# EAGLE design USB-Audio_ver_1_0 (EAGLE 9.6.2)
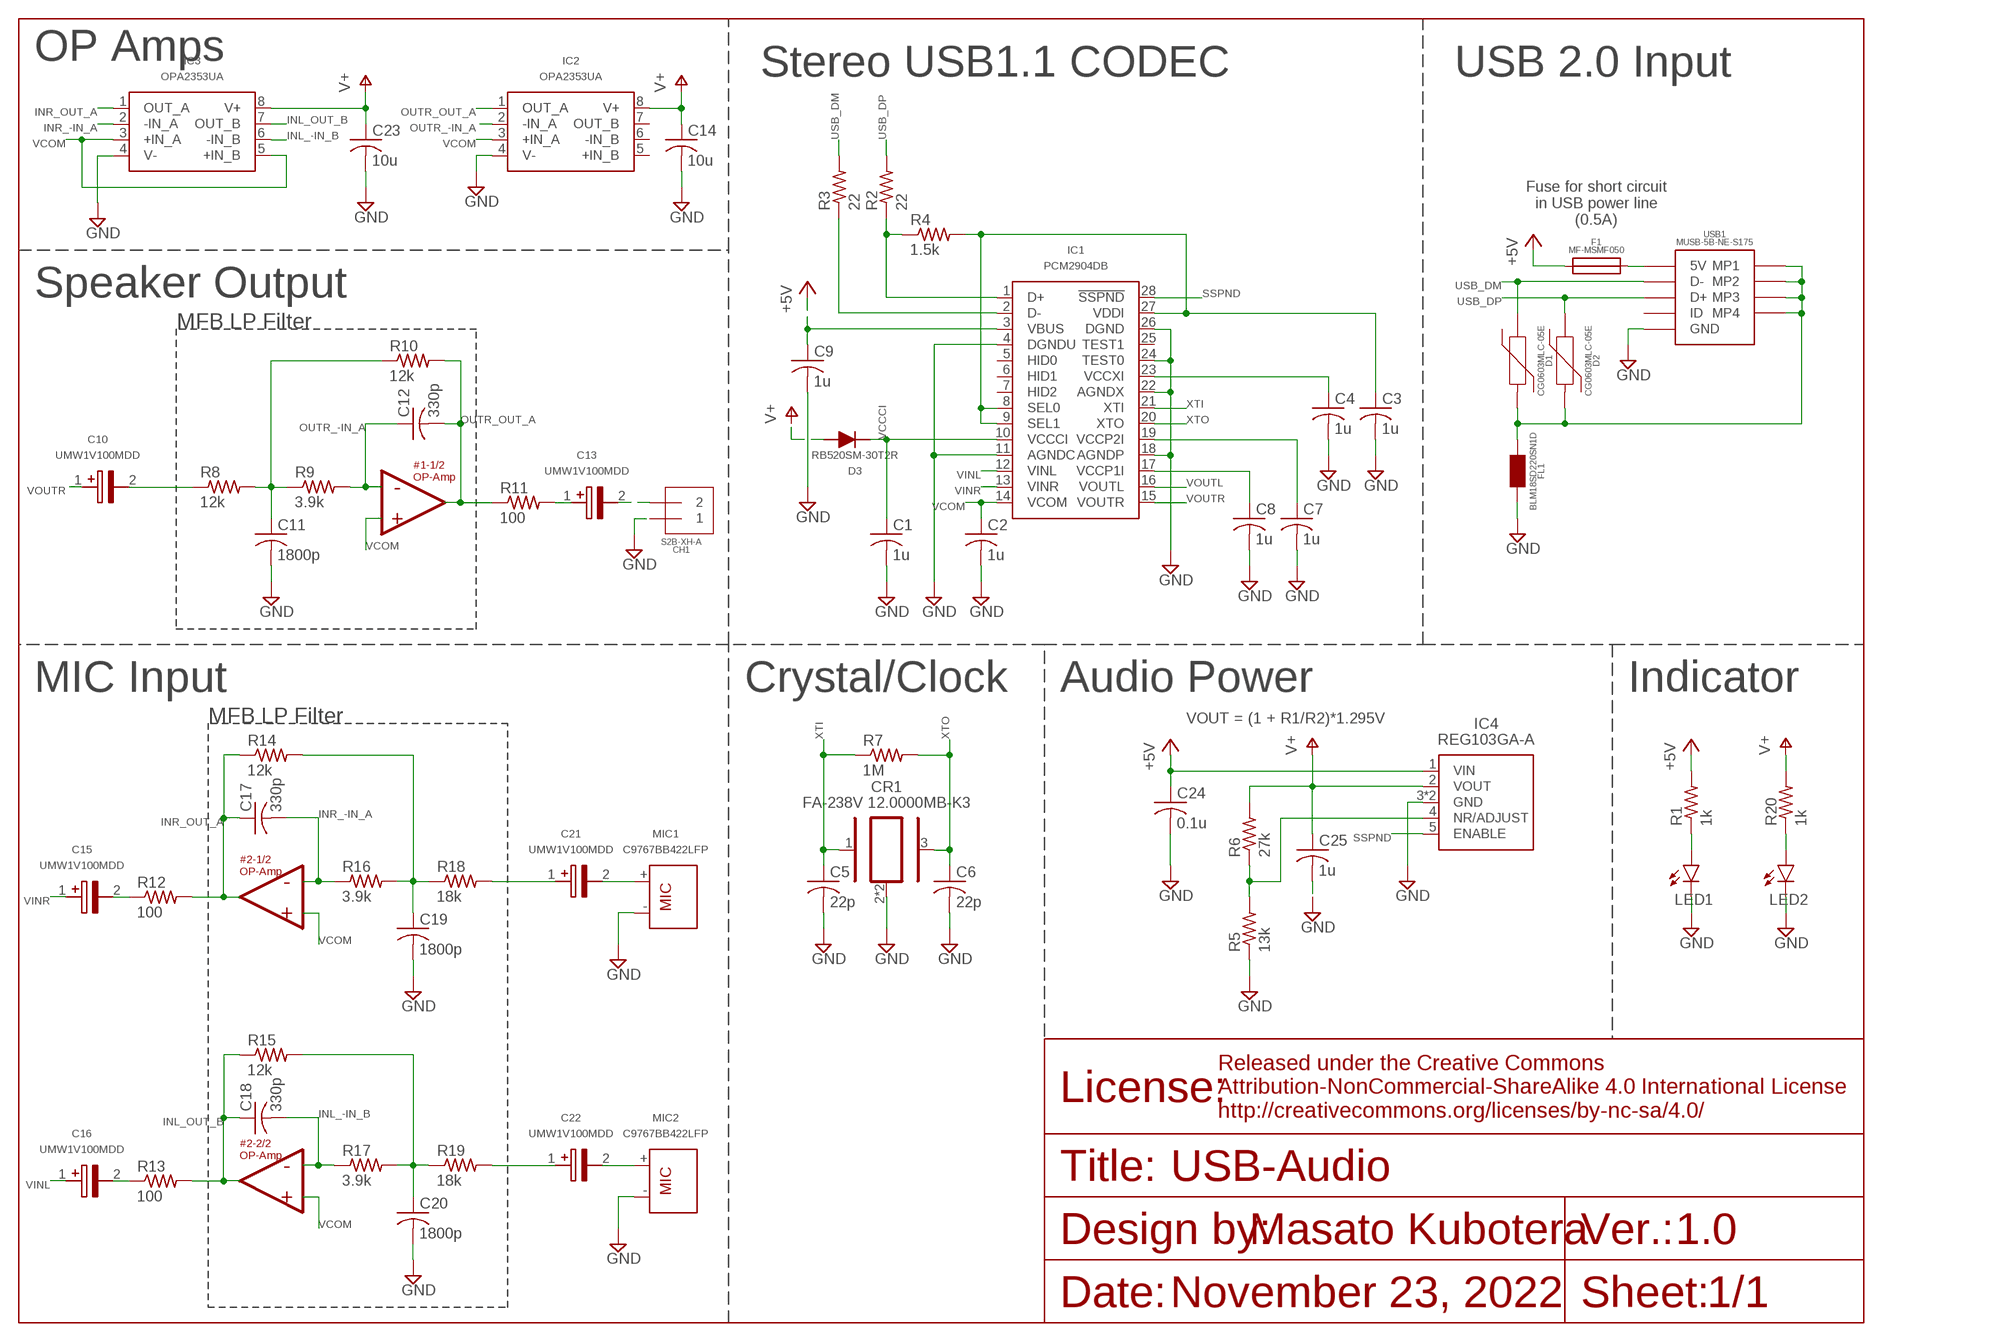
[diagram p0: schematic, sheet 1]

## Parts
C1  1u  C-USC1608  [C1608]
C2  1u  C-USC1608  [C1608]
C3  1u  C-USC1608  [C1608]
C4  1u  C-USC1608  [C1608]
C5  22p  C-USC1608  [C1608]
C6  22p  C-USC1608  [C1608]
C7  1u  C-USC1608  [C1608]
C8  1u  C-USC1608  [C1608]
C9  1u  C-USC1608  [C1608]
C10  UMW1V100MDD  [UMW1V100MDD]
C11  1800p  C-USC1608  [C1608]
C12  330p  C-USC1608  [C1608]
C13  UMW1V100MDD  [UMW1V100MDD]
C14  10u  C-USC1608  [C1608]
C15  UMW1V100MDD  [UMW1V100MDD]
C16  UMW1V100MDD  [UMW1V100MDD]
C17  330p  C-USC1608  [C1608]
C18  330p  C-USC1608  [C1608]
C19  1800p  C-USC1608  [C1608]
C20  1800p  C-USC1608  [C1608]
C21  UMW1V100MDD  [UMW1V100MDD]
C22  UMW1V100MDD  [UMW1V100MDD]
C23  10u  C-USC1608  [C1608]
C24  0.1u  C-USC1608  [C1608]
C25  1u  C-USC1608  [C1608]
CH1  S2B-XH-A  [S2B-XH-A]
CR1  FA-238V12.0000MB-K3  [FA238V]
D1  CG0603MLC-05E  [CG0603MLC-05E]
D2  CG0603MLC-05E  [CG0603MLC-05E]
D3  RB520SM-30T2R  [SOD-523-2]
F1  MF-MSMF050  [MF-MSMF050]
FL1  BLM18SD220SN1D  [BLM18SD220SN1D]
IC1  PCM2904DB  [PCM2904DB]
IC2  OPA2353UA  [OPA2353UA]
IC3  OPA2353UA  [OPA2353UA]
IC4  REG103GA-A  [SOT223-5]
LED1  LEDSML0603  [SML0603]
LED2  LEDSML0603  [SML0603]
MIC1  C9767BB422LFP  [C9767BB422LFP]
MIC2  C9767BB422LFP  [C9767BB422LFP]
R1  1k  R-US_R0603  [R0603]
R2  22  R-US_R0603  [R0603]
R3  22  R-US_R0603  [R0603]
R4  1.5k  R-US_R0603  [R0603]
R5  13k  R-US_R0603  [R0603]
R6  27k  R-US_R0603  [R0603]
R7  1M  R-US_R0603  [R0603]
R8  12k  R-US_R0603  [R0603]
R9  3.9k  R-US_R0603  [R0603]
R10  12k  R-US_R0603  [R0603]
R11  100  R-US_R0603  [R0603]
R12  100  R-US_R0603  [R0603]
R13  100  R-US_R0603  [R0603]
R14  12k  R-US_R0603  [R0603]
R15  12k  R-US_R0603  [R0603]
R16  3.9k  R-US_R0603  [R0603]
R17  3.9k  R-US_R0603  [R0603]
R18  18k  R-US_R0603  [R0603]
R19  18k  R-US_R0603  [R0603]
R20  1k  R-US_R0603  [R0603]
USB1  MINI_USB_B_SMD  [MINI_USB_B_SMD]

## Nets
+5V [USB-Power]: C9.1 C24.1 F1.1 IC1.3(VBUS) IC4.1(VIN) R1.2
B_FUSE_USB_MINI_B [USB-Power]: F1.2 USB1.1(5V)
DM: IC1.2(D-) R3.1
DP: IC1.1(D+) R2.1 R4.1
GND: C1.2 C2.2 C3.2 C4.2 C5.2 C6.2 C7.2 C8.2 C9.2 C11.2 C14.2 C19.2 C20.2 C23.2 C24.2 C25.2 CH1.1 CR1.2 CR1.4 FL1.2 IC1.4(DGNDU) IC1.11(AGNDC) IC1.18(AGNDP) IC1.22(AGNDX) IC1.24(TEST0) IC1.26(DGND) IC2.4(V-) IC3.4(V-) IC4.3(GND) IC4.6(GND) LED1.C LED2.C MIC1.- MIC2.- R5.1 USB1.5(GND)
INL_-IN_B: C18.2 IC3.6(-IN_B) R17.1
INL_OUT_B: C18.1 IC3.7(OUT_B) R13.2 R15.1
INR_-IN_A: C17.2 IC3.2(-IN_A) R16.1
INR_OUT_A: C17.1 IC3.1(OUT_A) R12.2 R14.1
LED_USBIN [LED-Power]: LED1.A R1.1
LED_USBIN1 [LED-Power]: LED2.A R20.1
MIC_INL: C22.2(-) MIC2.+
MIC_INR: C21.2(-) MIC1.+
N$1: C15.2(-) R12.1
N$2: C7.1 IC1.19(VCCP2I)
N$3: C13.2(-) CH1.2
N$4: IC4.4(NR/ADJUST) R5.2 R6.1
N$5: C13.1(+) R11.2
N$6: C10.2(-) R8.1
N$7: C11.1 R8.2 R9.1 R10.1
N$9: C16.2(-) R13.1
N$10: C19.1 R14.2 R16.2 R18.1
N$11: C21.1(+) R18.2
N$14: C22.1(+) R19.2
N$15: C20.1 R15.2 R17.2 R19.1
OUTR_-IN_A: C12.1 IC2.2(-IN_A) R9.2
OUTR_OUT_A: C12.2 IC2.1(OUT_A) R10.2 R11.1
SSPND: C8.1 IC1.17(VCCP1I) IC1.28(!SSPND) IC4.5(ENABLE)
USB_DM: D1.1 R3.2 USB1.2(D-)
USB_DP: D2.1 R2.2 USB1.3(D+)
USB_MINI_B_SHIELD [USB-Data]: D1.2 D2.2 FL1.1 USB1.MP1 USB1.MP2 USB1.MP3 USB1.MP4
V+ [USB-Power]: C14.1 C23.1 C25.1 D3.2(A) IC2.8(V+) IC3.8(V+) IC4.2(VOUT) R6.2 R20.2
VCCCI [USB-Power]: C1.1 D3.1(K) IC1.10(VCCCI)
VCCXI [USB-Power]: C4.1 IC1.23(VCCXI)
VCOM [USB-Power]: C2.1 IC1.14(VCOM) IC2.3(+IN_A) IC3.3(+IN_A) IC3.5(+IN_B)
VDDI [USB-Power]: C3.1 IC1.8(SEL0) IC1.9(SEL1) IC1.27(VDDI) R4.2
VINL: C16.1(+) IC1.12(VINL)
VINR: C15.1(+) IC1.13(VINR)
VOUTL [Audio-Output]: IC1.16(VOUTL)
VOUTR [Audio-Output]: C10.1(+) IC1.15(VOUTR)
XTI: C5.1 CR1.1 IC1.21(XTI) R7.1
XTO: C6.1 CR1.3 IC1.20(XTO) R7.2
Unconnected: IC1.5(HID0) IC1.6(HID1) IC1.7(HID2) IC1.25(TEST1) IC2.5(+IN_B) IC2.6(-IN_B) IC2.7(OUT_B) USB1.4(ID)

## Notes on the sheet
- OP Amps
- Stereo USB1.1 CODEC | USB 2.0 Input
- Fuse for short circuit
  in USB power line
  (0.5A)
- Speaker Output
- MFB LP Filter
- #1-1/2
  OP-Amp
- -
- +
- MIC Input | Crystal/Clock | Audio Power | Indicator
- MFB LP Filter | VOUT = (1 + R1/R2)*1.295V
- #2-1/2
  OP-Amp
- -
- +
- #2-2/2
  OP-Amp
- - | USB-Audio
- +
- 1.0
- November 23, 2022 | 1/1

## Library data of the parts
C1-C9 C11 C12 C14 C17-C20 C23-C25 = rcl:C-US: CAPACITOR, American symbol; SPICEPREFIX: C
C10 C13 C15 C16 C21 C22 = UMW1V100MDD:UMW1V100MDD
CH1 = JST-XH:S2B-XH-A
CR1 = FA238V:FA-238V12.0000MB-K3
D1 D2 = CG0603MLC-05E:CG0603MLC-05E
D3 = RB520SM-30T2R:RB520SM-30T2R
F1 = MF-MSMF:MF-MSMF050
FL1 = BLM18SD220SN1D:BLM18SD220SN1D
IC1 = PCM2904DB:PCM2904DB
IC2 IC3 = OPA2353UA:OPA2353UA
IC4 = REG103GA-A:REG103GA-A
LED1 LED2 = led:LED: LED OSRAM: - CHIPLED LG R971, LG N971, LY N971, LG Q971, LY Q971, LO R971, LY R971 LH N974, LH R974 LS Q976, LO Q976, LY Q976 LO Q996 - Hyper CHIPLED LW Q18S LB Q993, LB Q99A, LB R99A - SideLED LS A670, LO A670, LY A670, LG A670, LP A670 LB A673, LV A673, LT A673, LW A673 LH A674 LY A675 LS A676, LA A676, LO A676, LY A676, LW A676 LS A679, LY A679, LG A679 - Hyper Micro SIDELED® LS Y876, LA Y876, LO Y876, LY Y876 LT Y87S - SmartLED LW L88C, LW L88S LB L89C, LB L89S, LG L890 LS L89K, LO L89K, LY L89K LS L896, LA L896, LO L896, LY L896 - TOPLED LS T670, LO T670, LY T670, LG T670, LP T670 LSG T670, LSP T670, LSY T670, LOP T670, LYG T670 LG T671, LOG T671, LSG T671 LB T673, LV T673, LT T673, LW T673 LH T674 LS T676, LA T676, LO T676, LY T676, LB T676, LH T676, LSB T676, LW T676 LB T67C, LV T67C, LT T67C, LS T67K, LO T67K, LY T67K, LW E67C LS E67B, LA E67B, LO E67B, LY E67B, LB E67C, LV E67C, LT E67C LW T67C LS T679, LY T679, LG T679 LS T770, LO T770, LY T770, LG T770, LP T770 LB T773, LV T773, LT T773, LW T773 LH T774 LS E675, LA E675, LY E675, LS T675 LS T776, LA T776, LO T776, LY T776, LB T776 LHGB T686 LT T68C, LB T68C - Hyper Mini TOPLED® LB M676 - Mini TOPLED Santana® LG M470 LS M47K, LO M47K, LY M47K Source: http://www.osram.convergy.de LUXEON: - LUMILED® LXK2-PW12-R00, LXK2-PW12-S00, LXK2-PW14-U00, LXK2-PW14-V00 LXK2-PM12-R00, LXK2-PM12-S00, LXK2-PM14-U00 LXK2-PE12-Q00, LXK2-PE12-R00, LXK2-PE12-S00, LXK2-PE14-T00, LXK2-PE14-U00 LXK2-PB12-K00, LXK2-PB12-L00, LXK2-PB12-M00, LXK2-PB14-N00, LXK2-PB14-P00, LXK2-PB14-Q00 LXK2-PR12-L00, LXK2-PR12-M00, LXK2-PR14-Q00, LXK2-PR14-R00 LXK2-PD12-Q00, LXK2-PD12-R00, LXK2-PD12-S00 LXK2-PH12-R00, LXK2-PH12-S00 LXK2-PL12-P00, LXK2-PL12-Q00, LXK2-PL12-R00 Source: www.luxeon.com KINGBRIGHT: KA-3528ASYC Source: www.kingbright.com
MIC1 MIC2 = C9767BB422LFP:C9767BB422LFP
R1-R20 = rcl:R-US_: RESISTOR, American symbol; SPICEPREFIX: R
USB1 = USB_Connector:MINI_USB_B_SMD

## Net classes
0 default: width 0.203 mm
1 USB-Data: width 0.203 mm, drill 0.127 mm, clearance 0.203 mm
2 USB-Power: width 0.254 mm, drill 0.127 mm, clearance 0.203 mm
3 LED-Power: width 0.254 mm, drill 0.127 mm, clearance 0.203 mm

## Board
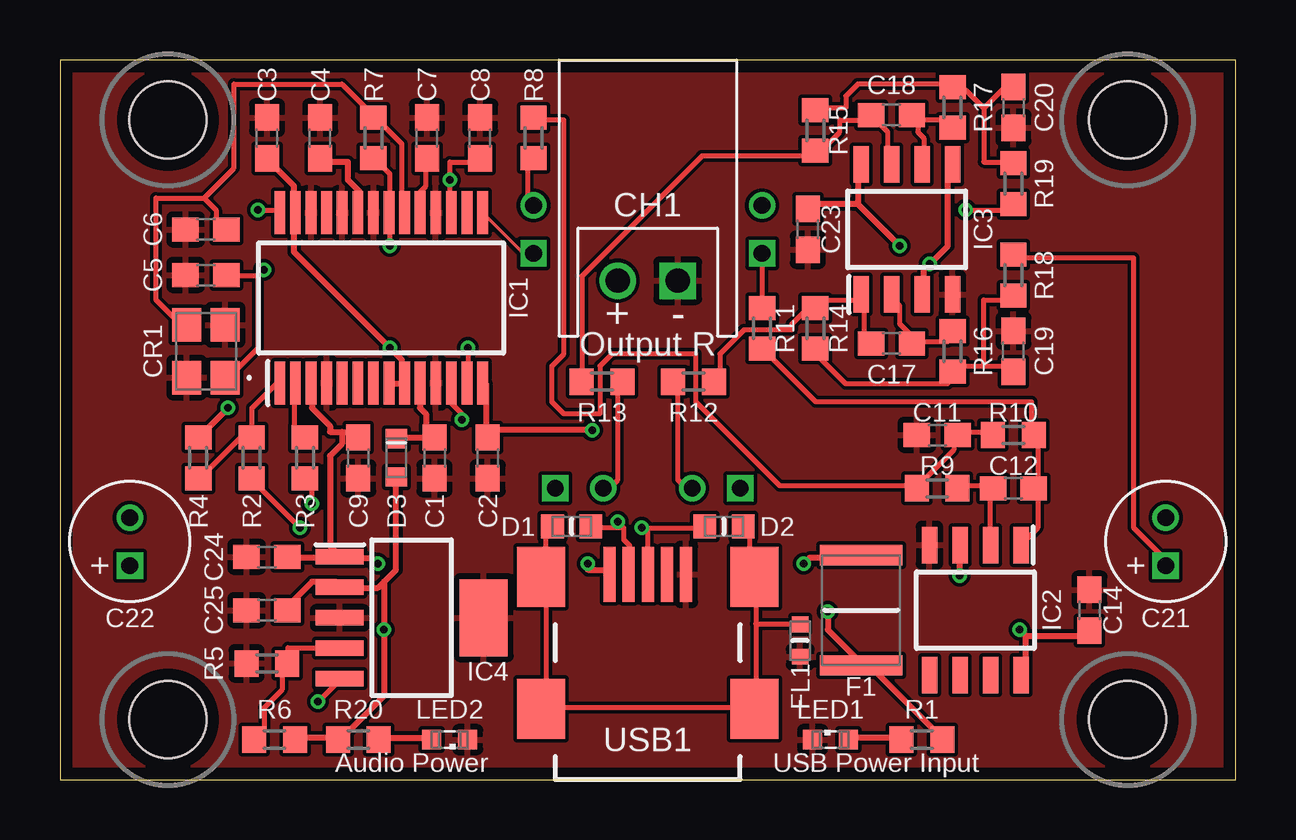
[diagram p1: board, top side]
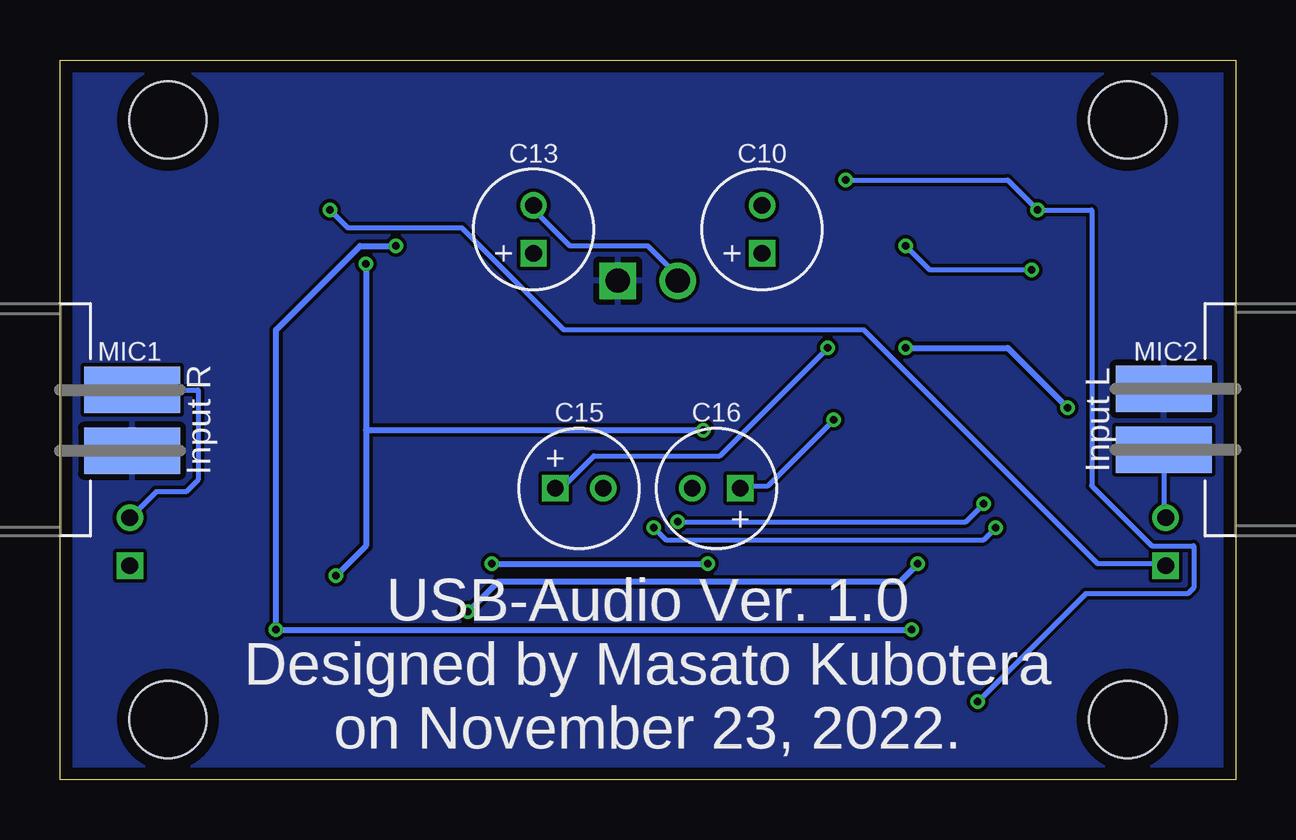
[diagram p2: board, bottom side, seen from below]

Size 49 x 30 mm. Coordinates in mm from the lower left corner, seen from the top.
Outline: 0,0 49,0 49,30 0,30 0,0
Copper layers (1*16): Top 0.035mm / dielectric 1.6mm / Bottom 0.035mm
Design rules "Elecrow_2-layer_PCB_eagle_rule": minimum track width 6mil, minimum drill 12mil, track to track 6mil, track to pad 6mil, pad to pad 6mil, via to via 8mil, smd to smd 0mil, copper to edge 20mil, drill to drill 10mil, minimum pad ring 6mil, minimum via ring 6mil, stop-mask expansion 0mil, vias tented up to drill 100mil, thermal gap 10mil
Holes 3.2 mm at 4.5,2.5 44.5,2.5 44.5,27.5 4.5,27.5

### Footprints (pad centres in the part's own frame; a part is rotated, then mirrored left to right if it is on the bottom)
C1608 = smd 1.1 x 1: 1 -0.85,0; 2 0.85,0
UMW1V100MDD = drill 0.7 pad 1.1 square: 1 -1,0 | drill 0.7 pad 1.1: 2 1,0
S2B-XH-A = drill 1.016 square: 1 1.25,0 | drill 1.016: 2 -1.25,0
FA238V = smd 1.4 x 1.2: 1 -1.1,-0.8; 2 1.1,-0.8; 3 1.1,0.8; 4 -1.1,0.8
CG0603MLC-05E = smd 0.95 x 1: 1 -0.8,0; 2 0.8,0
SOD-523-2 = smd 0.8 x 0.9: 1 -0.8,0; 2 0.8,0
MF-MSMF050 = smd 0.85 x 3.43: 1 -2.3,0; 2 2.3,0
BLM18SD220SN1D = smd 0.65 x 0.7: 1 -0.675,0; 2 0.675,0
PCM2904DB = smd 1.8 x 0.45: 1 -3.55,4.225; 2 -3.55,3.575; 3 -3.55,2.925; 4 -3.55,2.275; 5 -3.55,1.625; 6 -3.55,0.975; 7 -3.55,0.325; 8 -3.55,-0.325; 9 -3.55,-0.975; 10 -3.55,-1.625; 11 -3.55,-2.275; 12 -3.55,-2.925; 13 -3.55,-3.575; 14 -3.55,-4.225; 15 3.55,-4.225; 16 3.55,-3.575; 17 3.55,-2.925; 18 3.55,-2.275; 19 3.55,-1.625; 20 3.55,-0.975; 21 3.55,-0.325; 22 3.55,0.325; 23 3.55,0.975; 24 3.55,1.625; 25 3.55,2.275; 26 3.55,2.925; 27 3.55,3.575; 28 3.55,4.225
OPA2353UA = smd 1.528 x 0.65: 1 -2.711,1.905; 2 -2.711,0.635; 3 -2.711,-0.635; 4 -2.711,-1.905; 5 2.711,-1.905; 6 2.711,-0.635; 7 2.711,0.635; 8 2.711,1.905
SOT223-5 = smd 2 x 0.65: 1 -3,2.54; 2 -3,1.27; 3 -3,0; 4 -3,-1.27; 5 -3,-2.54 | smd 2 x 3.2: 6 3,0
SML0603 = smd 0.8 x 0.8: A 0.75,0; C -0.75,0
C9767BB422LFP = smd 4 x 1.93: + 3,1.25; - 3,-1.29
R0603 = smd 1 x 1.1: 1 -0.85,0; 2 0.85,0
MINI_USB_B_SMD = smd 0.5 x 2.3: 1 -1.6,8.55; 2 -0.8,8.55; 3 0,8.55; 4 0.8,8.55; 5 1.6,8.55 | smd 2 x 2.5: MP1 -4.45,8.45; MP2 4.45,8.45; MP3 4.45,2.95; MP4 -4.45,2.95

### Placement (x,y rotation side)
C1  15.61,13.41 270 top
C2  17.83,13.41 270 top
C3  8.62,26.75 90 top
C4  10.85,26.75 90 top
C5  6.09,21.03 180 top
C6  6.09,22.94 180 top
C7  15.29,26.75 90 top
C8  17.52,26.75 90 top
C9  12.44,13.41 270 top
C10  19.74,22.94 90 bottom
C11  36.56,14.37 180 top
C12  39.74,12.14 0 top
C13  29.26,22.94 90 bottom
C14  42.91,7.06 90 top
C15  27.36,12.14 0 bottom
C16  21.64,12.14 180 bottom
C17  34.66,18.18 0 top
C18  34.66,27.7 0 top
C19  39.74,17.86 90 top
C20  39.74,28.02 270 top
C21  46.09,9.92 90 top
C22  2.91,9.92 90 top
C23  31.17,22.94 270 top
C24  8.62,9.29 180 top
C25  8.62,7.06 180 top
CH1  24.5,20.8 0 top
CR1  6.09,17.86 90 top
D1  21.32,10.55 180 top
D2  27.68,10.55 0 top
D3  14.02,13.41 270 top
F1  33.39,7.06 90 top
FL1  30.85,5.79 270 top
IC1  13.39,20.08 90 top
IC2  38.15,7.06 270 top
IC3  35.3,22.94 90 top
IC4  14.66,6.74 0 top
LED1  32.12,1.66 0 top
LED2  16.24,1.66 180 top
MIC1  49,15 0 bottom
MIC2  0,15 180 bottom
R1  35.93,1.66 0 top
R2  7.99,13.41 270 top
R3  10.21,13.41 270 top
R4  5.77,13.41 90 top
R5  8.62,4.84 0 top
R6  8.94,1.66 0 top
R7  13.07,26.75 90 top
R8  19.74,26.75 90 top
R9  36.56,12.14 0 top
R10  39.74,14.37 0 top
R11  29.26,18.81 90 top
R12  26.41,16.59 0 top
R13  22.59,16.59 180 top
R14  31.48,18.81 270 top
R15  31.48,27.06 90 top
R16  37.2,17.86 270 top
R17  37.2,28.02 90 top
R18  39.74,21.03 90 top
R19  39.74,24.84 270 top
R20  12.44,1.66 180 top
USB1  24.5,0 0 top

### Tracks (layer width: path | path; a pad name or v marks a point on that pad's centre or on a via)
+5V  (via drill 0.3)
  Top 0.254: R1.2 36.75,1.75 33.5,5 F1.1 33.25,5 32,6.25 v32,7 | C24.1 9.5,9.25 11.5,9.25 IC4.1 | 11.75,14.5 11.25,14.5 11.25,14.75 10.5,15.5 10.5,16.5 IC1.3 | 11.75,14.5 12.25,14.5 C9.1 | 11.75,14.5 11.75,14 11.25,13.5 11.25,9.75 11.5,9.5 IC4.1 | v13.25,9 13,9.25 11.75,9.25 IC4.1
  Bottom 0.254: v32,7 30.75,8.25 14,8.25 v13.25,9
B_FUSE_USB_MINI_B  (via drill 0.3)
  Top 0.254: v22,9 22,8.75 22.75,8.75 USB1.1 | v31,9 31.25,9.25 33.25,9.25 F1.2
  Bottom 0.254: v31,9 v22,9
DM
  Top 0.203: R3.1 10,14.5 9.75,14.75 9.75,16.5 IC1.2
DP
  Top 0.203: R4.1 6,12.75 7.75,14.5 R2.1 8,14.5 8,15.5 9,16.5 IC1.1
GND
  pour Top: -0.9,32.78 -0.9,-2.78 49.9,-2.78 49.9,32.78
  pour Bottom: -3.44,35.32 -3.44,-5.32 52.44,-5.32 52.44,35.32
INL_-IN_B
  Top 0.203: 35.75,27.5 37,27.5 37,27.25 R17.1 | 35.75,27.5 35.75,27 36,26.75 36,25.75 IC3.6 | 35.75,27.5 C18.2
INL_OUT_B
  Top 0.203: IC3.7 34.5,25.75 34.5,27 34,27.5 C18.1 33.75,27.5 32.5,27.5 32.5,27 31.5,26 R15.1 31.25,26 26.75,26 21.75,21 21.75,16.75 R13.2
INR_-IN_A
  Top 0.203: R16.1 37,18.5 37,18.25 35.75,18.25 C17.2 35.5,18.25 35.5,18.5 35,19 35,19.75 34.75,20 IC3.2
INR_OUT_A
  Top 0.203: C17.1 33.75,18.25 33.5,18.5 33.5,20 IC3.1 33.25,20 31.5,20 31.5,19.75 R14.1 31.25,19.75 30.5,19 30.5,18.75 28.5,18.75 27.5,17.75 27.5,16.75 R12.2
LED_USBIN
  Top 0.254: LED1.A 33,1.75 35,1.75 R1.1
LED_USBIN1
  Top 0.254: LED2.A 15.25,1.75 13.5,1.75 R20.1
MIC_INL
  Bottom 0.203: MIC2.+ 3,11 C22.2
MIC_INR
  Bottom 0.203: MIC1.+ 43.25,16.25 43.25,12.5 43.75,12 45,12 46,11 C21.2
N$1
  Top 0.203: R12.1 25.75,16.5 25.75,12.5 26.25,12 C15.2
N$2
  Top 0.203: C7.1 15.25,25.75 15.25,24.75 15,24.5 15,23.75 IC1.19
N$3
  Bottom 0.203: C13.2 29.25,23.75 27.75,22.25 24.5,22.25 23.25,21 CH1.2
N$4
  Top 0.203: R6.1 8.25,1.75 8.5,2 8.5,3 9.25,3.75 9.25,4.75 R5.2 9.5,5 9.5,5.5 11.5,5.5 IC4.4
N$5
  Top 0.203: R11.2 29.25,19.75 29.25,21.75 C13.1
N$6
  Top 0.203: R8.1 19.5,25.75 19.5,24 C10.2
N$7
  Top 0.203: R10.1 38.75,14.5 37.5,14.5 C11.1 37.25,14.25 37.25,13.75 35.75,12.25 R9.1 35.5,12.25 30,12.25 26.5,15.75 26.5,17.75 23,17.75 22.5,17.25 22.5,15.25 21,15.25 20.5,15.75 20.5,17.25 21,17.75 21,27.5 19.75,27.5 R8.2
N$9
  Top 0.203: R13.1 23.25,16.5 23.25,12.5 22.75,12 C16.2
N$10
  Top 0.203: R14.2 31.5,17.75 32.75,16.5 37,16.5 37,17 R16.2 37.25,17.25 38.5,17.25 | 38.5,17.25 39.5,17.25 C19.1 | 38.5,17.25 38.5,20 39.5,20 R18.1
N$11
  Top 0.203: R18.2 39.75,21.75 44.75,21.75 44.75,10.5 46,9.25 46,9 C21.1
N$14  (via drill 0.3)
  Top 0.203: v37.75,23.75 39.5,23.75 R19.2
  Bottom 0.203: v37.75,23.75 37,23 32.25,23 28,18.75 15.5,18.75 5.75,9 3,9 C22.1
N$15
  Top 0.203: 38.5,28 38.5,25.75 39.5,25.75 R19.1 | 38.5,28 39.5,29 C20.1 | R15.2 31.5,28 32.75,28 32.75,28.5 33.25,29 37,29 R17.2 37.25,28.75 37.75,28.75 38.5,28
OUTR_-IN_A
  Top 0.203: R9.2 37.5,12.25 38.75,12.25 C12.1 38.75,12 38.75,10 IC2.2
OUTR_OUT_A
  Top 0.203: R11.1 29.5,17.75 31.5,15.75 40.5,15.75 40.5,14.5 R10.2 40.75,14.25 40.75,12.25 C12.2 40.75,12 40.75,10.5 40.25,10 IC2.1
SSPND  (via drill 0.3)
  Top 0.203: C8.1 17.5,25.75 16.25,25.75 v16.25,25 16.25,23.75 IC1.17 | v8.25,23.75 9,23.75 IC1.28 | v10.75,3.25 11.5,4 IC4.5
  Bottom 0.203: v16.25,25 9.5,25 v8.25,23.75 6,23.75 6,12.25 3.5,9.75 1.75,9.75 1.75,8 2,7.75 6.25,7.75 v10.75,3.25
USB_DM  (via drill 0.3)
  Top 0.203: 23.25,10.5 23.5,10.5 23.5,10 23.75,9.75 23.75,8.75 USB1.2 | 23.25,10.5 22.25,10.5 D1.1 | v10.5,11.5 10.5,12.25 10.25,12.5 R3.2 | 23.25,10.5 v23.25,10.75
  Bottom 0.203: v10.5,11.5 11.25,10.75 v23.25,10.75
USB_DP  (via drill 0.3)
  Top 0.203: 24.5,10.5 26.75,10.5 D2.1 | USB1.3 24.5,10.5 | v10,10.5 8,12.5 R2.2 | 24.5,10.5 v24.25,10.5
  Bottom 0.203: v10,10.5 10.5,10 23.75,10 v24.25,10.5
USB_MINI_B_SHIELD
  Top 0.203: D1.2 20.5,10.5 20.25,10.25 20.25,8.5 USB1.MP1 20.25,8.25 20.25,3 | 29,6.5 30.75,6.5 FL1.1 | 29,6.5 29,8.25 USB1.MP2 28.75,8.5 28.75,10.25 28.5,10.5 D2.2 | 29,6.5 29,3 USB1.MP3 28.75,3 20.25,3 | 20.25,3 USB1.MP4
V+  (via drill 0.3)
  Top 0.254: R6.2 10,1.75 11.5,1.75 R20.2 11.75,1.75 13.5,3.5 v13.5,6.25 13.5,8.25 | 13.5,8.25 13.25,8 11.75,8 IC4.2 11.5,8.25 10.5,8.25 9.5,7.25 C25.1 | 13.5,8.25 14,8.75 14,12.5 D3.2 | 33.25,24 31.25,24 C23.1 | 33.25,24 33.25,25.5 IC3.8 | 40.25,6 42.75,6 C14.1 | 40.25,6 40.25,4.5 IC2.8 | v35,22.25 33.25,24 | 40.25,6 v40,6.25
  Bottom 0.254: v35,22.25 36.5,22.25 40,18.75 v40,6.25 v13.5,6.25
VCCCI
  Top 0.254: D3.1 14.25,14.25 15.5,14.25 C1.1 15.5,14.5 15.25,14.75 15.25,15.25 15,15.5 15,16.5 IC1.10
VCCXI
  Top 0.254: C4.1 11,25.75 12,25.75 12,25 12.5,24.5 12.5,23.75 IC1.23
VCOM  (via drill 0.3)
  Top 0.254: IC1.14 17.75,16.5 17.75,14.5 C2.1 18.14,14.57 v22.18,14.57 | v37.5,8.5 37.5,9.75 IC2.3 | IC3.3 36,20.25 36,21.25 v36.25,21.5 37,22.25 37,25.5 IC3.5
  Bottom 0.254: v37.5,8.5 36.25,9.75 36.25,14.57 | v36.25,21.5 36.25,14.57 | 36.25,14.57 v22.18,14.57
VDDI  (via drill 0.3)
  Top 0.254: C3.1 8.75,25.75 9.75,24.75 9.75,23.75 IC1.27 9.75,23.5 9.75,22 v13.75,18 14.25,17.5 14.25,16.75 IC1.9 14.25,16.5 13.75,16.5 IC1.8 | v7,15.5 6,14.5 R4.2
  Bottom 0.254: v7,15.5 9.5,18 v13.75,18
VINL  (via drill 0.3)
  Top 0.203: v16.75,15 16.75,15.25 16.25,15.75 16.25,16.5 IC1.12
  Bottom 0.203: v16.75,15 19.5,12.25 20.5,12.25 C16.1
VINR  (via drill 0.3)
  Top 0.203: v17,18 17,16.75 IC1.13
  Bottom 0.203: v17,18 21.5,13.5 26.75,13.5 28,12.25 28.25,12.25 C15.1
VOUTR
  Top 0.152: IC1.15 17.75,23.5 19.5,21.75 C10.1
XTI  (via drill 0.3)
  Top 0.203: R7.1 13.25,25.75 13.75,25.25 13.75,23.75 IC1.21 13.75,23.5 v13.75,22.25 | 8.25,21 7,21 C5.1 | 8.25,21 8.25,18 7,16.75 CR1.1 | 8.25,21 v8.5,21.25
  Bottom 0.203: v13.75,22.25 12.75,21.25 v8.5,21.25
XTO
  Top 0.203: IC1.20 14.25,23.75 14.25,26.5 13.25,27.5 R7.2 13,27.75 11.75,29 7.25,29 7.25,25.5 6,24.25 | 6,24.25 6.5,23.75 6.5,23.25 6.75,23 C6.1 | 6,24.25 4,24.25 4,20 5.25,18.75 CR1.3

### Text on the board
tPlace: + | - | Output R
bPlace: Input L | Input R | USB-Audio Ver. 1.0 / Designed by Masato Kubotera / on November 23, 2022.
tNames: Audio Power | USB Power Input